# Altium schematic sheet Pi_FPGA.SchDoc: =DocumentName
size B; DrawnBy: Cary Smith; Organization: Las Cumbres Observatoy; Address1: 6740 Cortona Dr.; Address2: Suite 102; Address3: Goleta, CA 93117; DocumentNumber: 1; Revision: 1; SheetNumber: 1; SheetTotal: 1000's
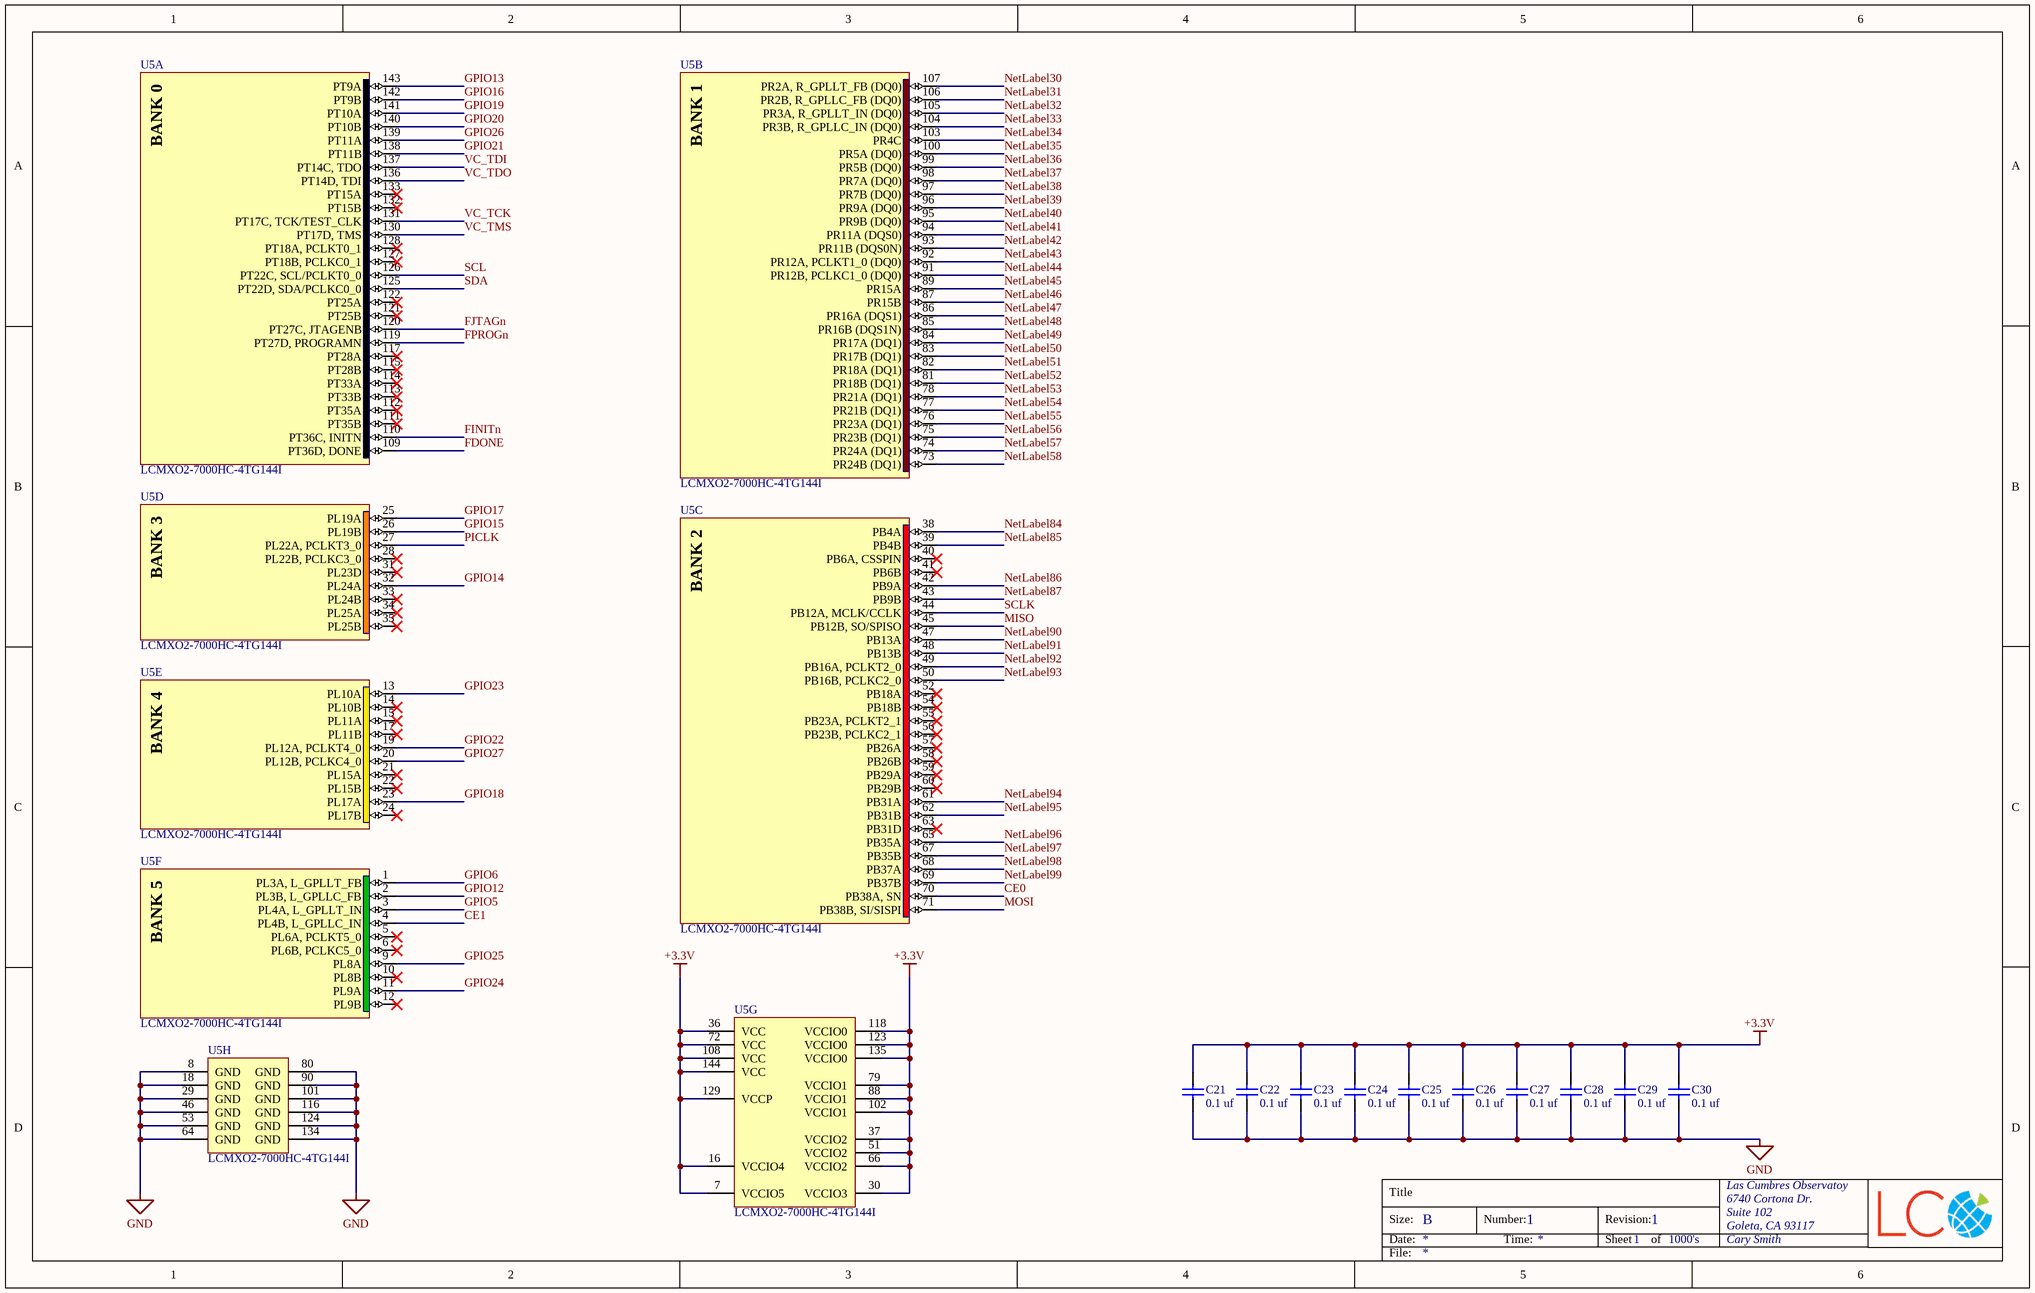
[diagram p0: Pi_FPGA.SchDoc]

## Parts
C21  0.1 uf  [CAPC1608X92X38LL15T08]
C22  0.1 uf  [CAPC1608X92X38LL15T08]
C23  0.1 uf  [CAPC1608X92X38LL15T08]
C24  0.1 uf  [CAPC1608X92X38LL15T08]
C25  0.1 uf  [CAPC1608X92X38LL15T08]
C26  0.1 uf  [CAPC1608X92X38LL15T08]
C27  0.1 uf  [CAPC1608X92X38LL15T08]
C28  0.1 uf  [CAPC1608X92X38LL15T08]
C29  0.1 uf  [CAPC1608X92X38LL15T08]
C30  0.1 uf  [CAPC1608X92X38LL15T08]
U5  LCMXO2-7000HC-4TG144I  [TQFP144_N]  (parts A,B,C,D,E,F,G,H of 8)

## Nets
+3.3V: C21.2 C22.2 C23.2 C24.2 C25.2 C26.2 C27.2 C28.2 C29.2 C30.2 U5.7(VCCIO5) U5.16(VCCIO4) U5.30(VCCIO3) U5.36(VCC) U5.37(VCCIO2) U5.51(VCCIO2) U5.66(VCCIO2) U5.72(VCC) U5.79(VCCIO1) U5.88(VCCIO1) U5.102(VCCIO1) U5.108(VCC) U5.118(VCCIO0) U5.123(VCCIO0) U5.129(VCCP) U5.135(VCCIO0) U5.144(VCC)
GND: C21.1 C22.1 C23.1 C24.1 C25.1 C26.1 C27.1 C28.1 C29.1 C30.1 U5.8(GND) U5.18(GND) U5.29(GND) U5.46(GND) U5.53(GND) U5.64(GND) U5.80(GND) U5.90(GND) U5.101(GND) U5.116(GND) U5.124(GND) U5.134(GND)
CE0: U5.70(PB38A,_SN)
CE1: U5.4(PL4B,_L_GPLLC_IN)
FDONE: U5.109(PT36D,_DONE)
FINITn: U5.110(PT36C,_INITN)
FJTAGn: U5.120(PT27C,_JTAGENB)
FPROGn: U5.119(PT27D,_PROGRAMN)
GPIO5: U5.3(PL4A,_L_GPLLT_IN)
GPIO6: U5.1(PL3A,_L_GPLLT_FB)
GPIO12: U5.2(PL3B,_L_GPLLC_FB)
GPIO13: U5.143(PT9A)
GPIO14: U5.32(PL24A)
GPIO15: U5.26(PL19B)
GPIO16: U5.142(PT9B)
GPIO17: U5.25(PL19A)
GPIO18: U5.23(PL17A)
GPIO19: U5.141(PT10A)
GPIO20: U5.140(PT10B)
GPIO21: U5.138(PT11B)
GPIO22: U5.19(PL12A,_PCLKT4_0)
GPIO23: U5.13(PL10A)
GPIO24: U5.11(PL9A)
GPIO25: U5.9(PL8A)
GPIO26: U5.139(PT11A)
GPIO27: U5.20(PL12B,_PCLKC4_0)
MISO: U5.45(PB12B,_SO/SPISO)
MOSI: U5.71(PB38B,_SI/SISPI)
NetLabel30: U5.107(PR2A,_R_GPLLT_FB_(DQ0))
NetLabel31: U5.106(PR2B,_R_GPLLC_FB_(DQ0))
NetLabel32: U5.105(PR3A,_R_GPLLT_IN_(DQ0))
NetLabel33: U5.104(PR3B,_R_GPLLC_IN_(DQ0))
NetLabel34: U5.103(PR4C)
NetLabel35: U5.100(PR5A_(DQ0))
NetLabel36: U5.99(PR5B_(DQ0))
NetLabel37: U5.98(PR7A_(DQ0))
NetLabel38: U5.97(PR7B_(DQ0))
NetLabel39: U5.96(PR9A_(DQ0))
NetLabel40: U5.95(PR9B_(DQ0))
NetLabel41: U5.94(PR11A_(DQS0))
NetLabel42: U5.93(PR11B_(DQS0N))
NetLabel43: U5.92(PR12A,_PCLKT1_0_(DQ0))
NetLabel44: U5.91(PR12B,_PCLKC1_0_(DQ0))
NetLabel45: U5.89(PR15A)
NetLabel46: U5.87(PR15B)
NetLabel47: U5.86(PR16A_(DQS1))
NetLabel48: U5.85(PR16B_(DQS1N))
NetLabel49: U5.84(PR17A_(DQ1))
NetLabel50: U5.83(PR17B_(DQ1))
NetLabel51: U5.82(PR18A_(DQ1))
NetLabel52: U5.81(PR18B_(DQ1))
NetLabel53: U5.78(PR21A_(DQ1))
NetLabel54: U5.77(PR21B_(DQ1))
NetLabel55: U5.76(PR23A_(DQ1))
NetLabel56: U5.75(PR23B_(DQ1))
NetLabel57: U5.74(PR24A_(DQ1))
NetLabel58: U5.73(PR24B_(DQ1))
NetLabel84: U5.38(PB4A)
NetLabel85: U5.39(PB4B)
NetLabel86: U5.42(PB9A)
NetLabel87: U5.43(PB9B)
NetLabel90: U5.47(PB13A)
NetLabel91: U5.48(PB13B)
NetLabel92: U5.49(PB16A,_PCLKT2_0)
NetLabel93: U5.50(PB16B,_PCLKC2_0)
NetLabel94: U5.61(PB31A)
NetLabel95: U5.62(PB31B)
NetLabel96: U5.65(PB35A)
NetLabel97: U5.67(PB35B)
NetLabel98: U5.68(PB37A)
NetLabel99: U5.69(PB37B)
PICLK: U5.27(PL22A,_PCLKT3_0)
SCL: U5.126(PT22C,_SCL/PCLKT0_0)
SCLK: U5.44(PB12A,_MCLK/CCLK)
SDA: U5.125(PT22D,_SDA/PCLKC0_0)
VC_TCK: U5.131(PT17C,_TCK/TEST_CLK)
VC_TDI: U5.137(PT14C,_TDO)
VC_TDO: U5.136(PT14D,_TDI)
VC_TMS: U5.130(PT17D,_TMS)

Not connected (* = marked no-connect by the designer): U5 5(PL6A,_PCLKT5_0)* 6(PL6B,_PCLKC5_0)* 10(PL8B)* 12(PL9B)* 14(PL10B)* 15(PL11A)* 17(PL11B)* 21(PL15A)* 22(PL15B)* 24(PL17B)* 28(PL22B,_PCLKC3_0)* 31(PL23D)* 33(PL24B)* 34(PL25A)* 35(PL25B)* 40(PB6A,_CSSPIN)* 41(PB6B)* 52(PB18A)* 54(PB18B)* 55(PB23A,_PCLKT2_1)* 56(PB23B,_PCLKC2_1)* 57(PB26A)* 58(PB26B)* 59(PB29A)* 60(PB29B)* 63(PB31D)* 111(PT35B)* 112(PT35A)* 113(PT33B)* 114(PT33A)* 115(PT28B)* 117(PT28A)* 121(PT25B)* 122(PT25A)* 127(PT18B,_PCLKC0_1)* 128(PT18A,_PCLKT0_1)* 132(PT15B)* 133(PT15A)*

## Notes on the sheet
- Title
- Size:
- Date:
- B
- Number:
- Time:
- Revision:
- Sheet
- of
- File:
- (in symbol CMP-0111-00300-1, part A) BANK 0
- (in symbol CMP-0111-00300-1, part B) BANK 1
- (in symbol CMP-0111-00300-1, part C) BANK 2
- (in symbol CMP-0111-00300-1, part D) BANK 3
- (in symbol CMP-0111-00300-1, part E) BANK 4
- (in symbol CMP-0111-00300-1, part F) BANK 5

## Library data of the parts
C21-C30 = CMP-2006-01974-1: VJ0603Y104KNXAO; Manufacturer: Vitramon; Part Number: VJ0603Y104KNXAO
U5 = CMP-0111-00300-1: MachXO2 High Performance CPLD with 6864 LUTs, Voltage Regulator, 2.5V/3.3V, 144-pin TQFP, Speed Grade-4, Industrial Grade, Halogen Free (RoHS); PackageVersion: ver02.6, Nov-2010; PackageDescription: 144-Pin Thin Quad Flat Pack (TQFP144); Code_JEDEC: MS-026-BFB; PackageReference: TQFP144; DatasheetVersion: ver01.0, Nov-2010